# Altium schematic sheet BV100011_ControlLcd.SchDoc
size A4
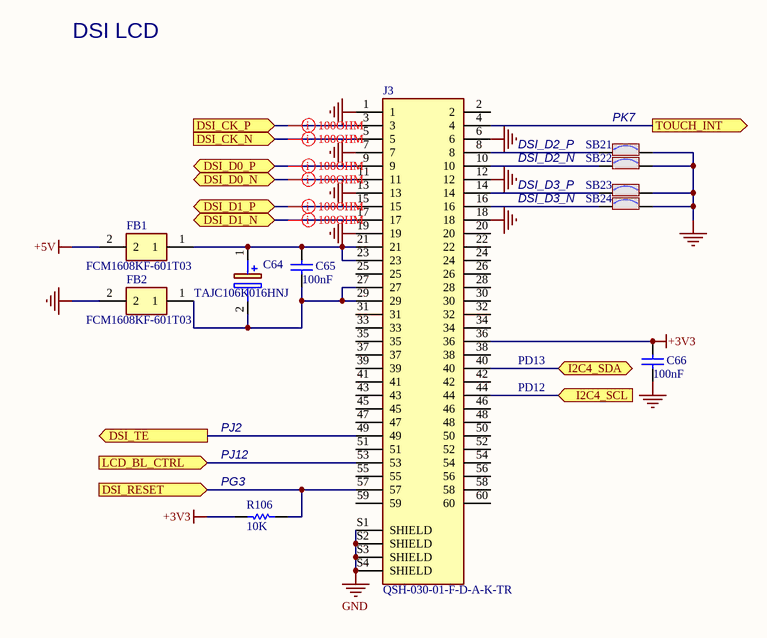
[diagram p0: BV100011_ControlLcd.SchDoc]

## Parts
C64  TAJC106K016HNJ  [CAPPM6032X280N]
C65  100nF  [C0603]
C66  100nF  [C0603]
FB1  FCM1608KF-601T03  [BEADC1608X95N]
FB2  FCM1608KF-601T03  [BEADC1608X95N]
J3  QSH-030-01-F-D-A-K-TR  [SAMTEC_QSH-030-01-F-D-A-K-TR]
R106  10K  [R0603]
SB21  Solder Bridge ON  [SB_0603]  (value not drawn)
SB22  Solder Bridge ON  [SB_0603]  (value not drawn)
SB23  Solder Bridge ON  [SB_0603]  (value not drawn)
SB24  Solder Bridge ON  [SB_0603]  (value not drawn)

## Ports
DSI_CK_N (in), DSI_CK_P (in), DSI_D0_N (bidir), DSI_D0_P (bidir), DSI_D1_N (bidir), DSI_D1_P (bidir), DSI_RESET (in), DSI_TE (out), I2C4_SCL (in), I2C4_SDA (bidir), LCD_BL_CTRL (in), TOUCH_INT (out)

## Nets
+3V3: C66.1 J3.36 R106.2
+5V: FB1.2
GND: C66.2 FB2.2 J3.1 J3.6 J3.7 J3.12 J3.13 J3.18 J3.19 J3.S1(SHIELD) J3.S2(SHIELD) J3.S3(SHIELD) J3.S4(SHIELD) SB21.2 SB22.2 SB23.2 SB24.2
DSI_CK_N: J3.5 ; port DSI_CK_N
DSI_CK_P: J3.3 ; port DSI_CK_P
DSI_D0_N: J3.11 ; port DSI_D0_N
DSI_D0_P: J3.9 ; port DSI_D0_P
DSI_D1_N: J3.17 ; port DSI_D1_N
DSI_D1_P: J3.15 ; port DSI_D1_P
DSI_RESET: J3.57 R106.1 ; port DSI_RESET
DSI_TE: J3.49 ; port DSI_TE
I2C4_SCL: J3.44 ; port I2C4_SCL
I2C4_SDA: J3.40 ; port I2C4_SDA
LCD_BL_CTRL: J3.53 ; port LCD_BL_CTRL
TOUCH_INT: J3.4 ; port TOUCH_INT
NetC64_1: C64.1(+) C65.1 FB1.1 J3.21 J3.23
NetC64_2: C64.2(-) C65.2 FB2.1 J3.27 J3.29
NetJ3_8: J3.8 SB21.1
NetJ3_10: J3.10 SB22.1
NetJ3_14: J3.14 SB23.1
NetJ3_16: J3.16 SB24.1

Not connected (* = marked no-connect by the designer): J3 2 20 22 24 25 26 28 30 31 32 33 34 35 37 38 39 41 42 43 45 46 47 48 50 51 52 54 55 56 58 59 60

## Layout directives
differential pair; differential pair class 100OHM; rule Matched Net Lengths [Tolerance = 100mil]: DSI_CK_N, DSI_CK_P, DSI_D0_N, DSI_D0_P, DSI_D1_N, DSI_D1_P

## Notes on the sheet
- DSI LCD
- DSI_D2_P
- PK7
- DSI_D2_N
- DSI_D3_P
- DSI_D3_N
- PD13
- PD12
- PJ12
- PJ2
- (near R106) PG3

## Library data of the parts
C64 = TAJC106K016HNJ: Capacitor Polarised; Manufacturer_Name: AVX; Datasheet Link: http://datasheets.avx.com/TAJ.pdf; Height: 2.8mm; Manufacturer_Part_Number: TAJC106K016HNJ
C65 C66 = Cap: Capacitor; Value: 10nF; Published: 8-Jun-2000; Revision: July-2002: Re-released for DXP Platform.; Publisher: Altium Limited
FB1 FB2 = FCM1608KF-601T03: Ferrite Bead; Manufacturer_Name: TAI-TECH; Datasheet Link: https://www.tai-tech.com.tw/_upload/files/FCM1608-Series.pdf; Height: 0.95mm; Manufacturer_Part_Number: FCM1608KF-601T03
J3 = QSH-030-01-F-D-A-K-TR: 60 Position Connector Receptacle, Center Strip Contacts Surface Mount Gold; MF: Samtec; SnapEDA_Link: https://www.snapeda.com/parts/QSH-030-01-F-D-A-K-TR/Samtec%20Inc./view-part/1154263/?ref=snap; Digi-Key_Part_Number: SAM13214CT-ND; Value: *; MP: QSH-030-01-F-D-A-K-TR; Digi-Key_Purchase_URL: https://www.digikey.com/product-detail/en/samtec-inc/QSH-030-01-F-D-A-K-TR/SAM13214CT-ND/8827969?utm_source=snapeda&utm_medium=aggregator&utm_campaign=symbol; Package: None
R106 = Res1: Resistor; Value: 1K; Published: 8-Jun-2000; Revision: July-2002: Re-released for DXP Platform.; Publisher: Altium Limited
SB21-SB24 = SB_ON: Fitted: YES; Ordered by: Subcon; Revision: July-2002: Re-released for DXP Platform.; ECCN_US/EU: n/a